# EAGLE design motoko_ice_dragon_v2 (EAGLE 9.6.0)
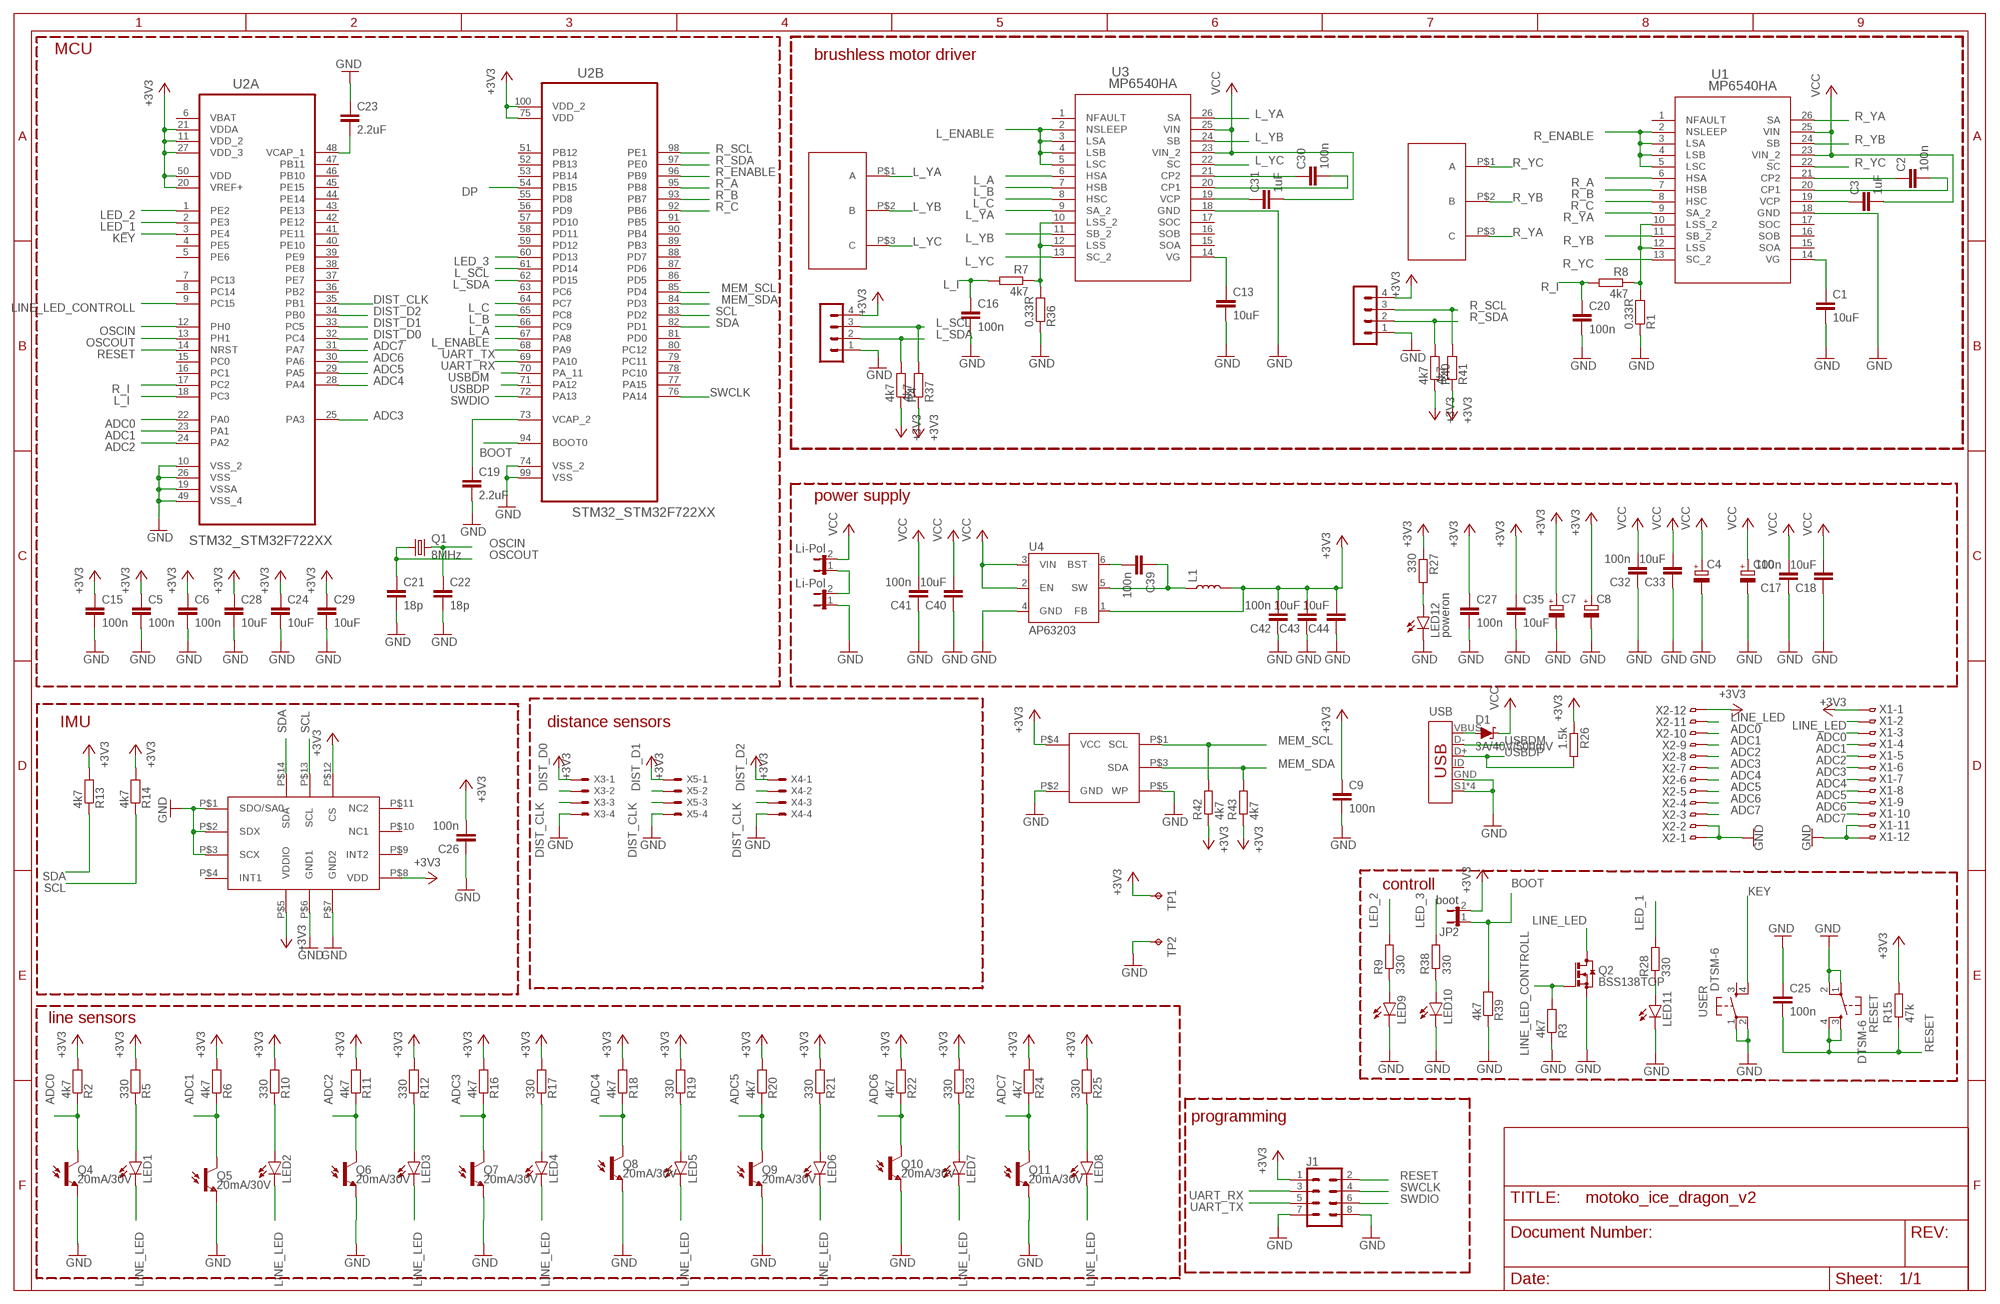
[diagram p0: schematic, sheet 1]

## Parts
C1  10uF  C-EUC0805  [C0805]
C2  100n  C-EUC0805  [C0805]
C3  1uF  C-EUC0805  [C0805]
C4  CPOL-EU085CS-1AR  [085CS_1AR]
C5  100n  C-EUC0805  [C0805]
C6  100n  C-EUC0805  [C0805]
C7  CPOL-EU085CS-1AR  [085CS_1AR]
C8  CPOL-EU085CS-1AR  [085CS_1AR]
C9  100n  C-EUC0805  [C0805]
C10  CPOL-EU085CS-1AR  [085CS_1AR]
C13  10uF  C-EUC0805  [C0805]
C15  100n  C-EUC0805  [C0805]
C16  100n  C-EUC0805  [C0805]
C17  100n  C-EUC0805  [C0805]
C18  10uF  C-EUC0805  [C0805]
C19  2.2uF  C-EUC0805  [C0805]
C20  100n  C-EUC0805  [C0805]
C21  18p  C-EUC0805  [C0805]
C22  18p  C-EUC0805  [C0805]
C23  2.2uF  C-EUC0805  [C0805]
C24  10uF  C-EUC0805  [C0805]
C25  100n  C-EUC0805  [C0805]
C26  100n  C-EUC0805  [C0805]
C27  100n  C-EUC0805  [C0805]
C28  10uF  C-EUC0805  [C0805]
C29  10uF  C-EUC0805  [C0805]
C30  100n  C-EUC0805  [C0805]
C31  1uF  C-EUC0805  [C0805]
C32  100n  C-EUC0805  [C0805]
C33  10uF  C-EUC0805  [C0805]
C35  10uF  C-EUC0805  [C0805]
C39  100n  C-EUC0805  [C0805]
C40  10uF  C-EUC0805  [C0805]
C41  100n  C-EUC0805  [C0805]
C42  100n  C-EUC0805  [C0805]
C43  10uF  C-EUC0805  [C0805]
C44  10uF  C-EUC0805  [C0805]
D1  3A/40V/500mV  DIODE-SCHOTTKY-B340A  [SMA-DIODE]
J1  CONN_04X2  [2X4]
JP1  Li-Pol  JP1E  [JP1]
JP2  boot  JP1E  [JP1]
JP3  Li-Pol  JP1E  [JP1]
L1  4.7uH, TYS50204R7N-10  INDUCTOR-CR54-3.3UH  [CR54]
L_ENCODER  MA04-1  [MA04-1]
L_ENCODER1  MA04-1  [MA04-1]
LED1  LEDCHIPLED_1206  [CHIPLED_1206]
LED2  LEDCHIPLED_1206  [CHIPLED_1206]
LED3  LEDCHIPLED_1206  [CHIPLED_1206]
LED4  LEDCHIPLED_1206  [CHIPLED_1206]
LED5  LEDCHIPLED_1206  [CHIPLED_1206]
LED6  LEDCHIPLED_1206  [CHIPLED_1206]
LED7  LEDCHIPLED_1206  [CHIPLED_1206]
LED8  LEDCHIPLED_1206  [CHIPLED_1206]
LED9  LEDCHIPLED_1206  [CHIPLED_1206]
LED10  LEDCHIPLED_1206  [CHIPLED_1206]
LED11  LEDCHIPLED_1206  [CHIPLED_1206]
LED12  poweron  LEDCHIPLED_1206  [CHIPLED_1206]
Q1  8MHz  CRYSTALCTS406  [CTS406]
Q2  BSS138TOP  [SOT23]
Q4  20mA/30V  PHOTOTRANSISTORPT17-21C-L41-TR8  [PT17-21C-L41-TR8]
Q5  20mA/30V  PHOTOTRANSISTORPT17-21C-L41-TR8  [PT17-21C-L41-TR8]
Q6  20mA/30V  PHOTOTRANSISTORPT17-21C-L41-TR8  [PT17-21C-L41-TR8]
Q7  20mA/30V  PHOTOTRANSISTORPT17-21C-L41-TR8  [PT17-21C-L41-TR8]
Q8  20mA/30V  PHOTOTRANSISTORPT17-21C-L41-TR8  [PT17-21C-L41-TR8]
Q9  20mA/30V  PHOTOTRANSISTORPT17-21C-L41-TR8  [PT17-21C-L41-TR8]
Q10  20mA/30V  PHOTOTRANSISTORPT17-21C-L41-TR8  [PT17-21C-L41-TR8]
Q11  20mA/30V  PHOTOTRANSISTORPT17-21C-L41-TR8  [PT17-21C-L41-TR8]
R1  0.33R  R-EU_M1206  [M1206]
R2  4k7  R-EU_M0805  [M0805]
R3  4k7  R-EU_M0805  [M0805]
R4  4k7  R-EU_M0805  [M0805]
R5  330  R-EU_M0805  [M0805]
R6  4k7  R-EU_M0805  [M0805]
R7  4k7  R-EU_M0805  [M0805]
R8  4k7  R-EU_M0805  [M0805]
R9  330  R-EU_M0805  [M0805]
R10  330  R-EU_M0805  [M0805]
R11  4k7  R-EU_M0805  [M0805]
R12  330  R-EU_M0805  [M0805]
R13  4k7  R-EU_M0805  [M0805]
R14  4k7  R-EU_M0805  [M0805]
R15  47k  R-EU_M0805  [M0805]
R16  4k7  R-EU_M0805  [M0805]
R17  330  R-EU_M0805  [M0805]
R18  4k7  R-EU_M0805  [M0805]
R19  330  R-EU_M0805  [M0805]
R20  4k7  R-EU_M0805  [M0805]
R21  330  R-EU_M0805  [M0805]
R22  4k7  R-EU_M0805  [M0805]
R23  330  R-EU_M0805  [M0805]
R24  4k7  R-EU_M0805  [M0805]
R25  330  R-EU_M0805  [M0805]
R26  1.5k  R-EU_M0805  [M0805]
R27  330  R-EU_M0805  [M0805]
R28  330  R-EU_M0805  [M0805]
R36  0.33R  R-EU_M1206  [M1206]
R37  4k7  R-EU_M0805  [M0805]
R38  330  R-EU_M0805  [M0805]
R39  4k7  R-EU_M0805  [M0805]
R40  4k7  R-EU_M0805  [M0805]
R41  4k7  R-EU_M0805  [M0805]
R42  4k7  R-EU_M0805  [M0805]
R43  4k7  R-EU_M0805  [M0805]
RESET  DTSM-6  [DTSM-6]
TP1  TPB1,27  [B1,27]
TP2  TPB1,27  [B1,27]
U1  MP6540HA  [QFN-5X5_MP6540HA_MNP]
U2  STM32_STM32F722XX  [STM32_QFP50P1600X1600X160-100N]
U3  MP6540HA  [QFN-5X5_MP6540HA_MNP]
U4  AP63203  [SOT23-6]
U$1  BRUSHLESS_GIMBAL_MOTOR_WHEEL  [BRUSHLESS_GIMBAL_MOTOR_WHEEL]
U$2  BRUSHLESS_GIMBAL_MOTOR_WHEEL  [BRUSHLESS_GIMBAL_MOTOR_WHEEL]
U$3  LSM6DSM  [LGA14L]
U$4  24LC24_SOT23  [SOT23]
USB  USB_MINI-B_SMT  [USB-MINIB]
USER  DTSM-6  [DTSM-6]
X1  FH12-12S-0.5SH  [FH12-12S-0.5SH]
X2  FH12-12S-0.5SH  [FH12-12S-0.5SH]
X3  52745-0490  [52745-0490]
X4  52745-0490  [52745-0490]
X5  52745-0490  [52745-0490]

## Nets
+3V3: C5.1 C6.1 C7.+ C8.+ C9.1 C15.1 C24.1 C26.2 C27.1 C28.1 C29.1 C35.1 C42.2 C43.2 C44.2 J1.1 JP2.2 L1.P$2 L_ENCODER1.4 L_ENCODER.4 R2.2 R4.1 R5.2 R6.2 R10.2 R11.2 R12.2 R13.2 R14.2 R15.2 R16.2 R17.2 R18.2 R19.2 R20.2 R21.2 R22.2 R23.2 R24.2 R25.2 R26.1 R27.1 R37.1 R40.1 R41.1 R42.1 R43.1 TP1.TP U2.11(A:VDD_2) U2.20(A:VREF+) U2.21(A:VDDA) U2.27(A:VDD_3) U2.50(A:VDD) U2.75(B:VDD) U2.100(B:VDD_2) U4.1(FB) U$3.P$5(VDDIO) U$3.P$8(VDD) U$3.P$12(CS) U$4.P$4(VCC) X1.1 X2.12 X3.1 X4.1 X5.1
ADC0: Q4.C R2.1 U2.22(A:PA0) X1.3 X2.10
ADC1: Q5.C R6.1 U2.23(A:PA1) X1.4 X2.9
ADC2: Q6.C R11.1 U2.24(A:PA2) X1.5 X2.8
ADC3: Q7.C R16.1 U2.25(A:PA3) X1.6 X2.7
ADC4: Q8.C R18.1 U2.28(A:PA4) X1.7 X2.6
ADC5: Q9.C R20.1 U2.29(A:PA5) X1.8 X2.5
ADC6: Q10.C R22.1 U2.30(A:PA6) X1.9 X2.4
ADC7: Q11.C R24.1 U2.31(A:PA7) X1.10 X2.3
BOOT: JP2.1 R39.2 U2.94(B:BOOT0)
DIST_CLK: U2.35(A:PB1) X3.3 X4.3 X5.3
DIST_D0: U2.32(A:PC4) X3.2
DIST_D1: U2.33(A:PC5) X5.2
DIST_D2: U2.34(A:PB0) X4.2
DP: U2.54(B:PB15)
GND: C1.2 C4.- C5.2 C6.2 C7.- C8.- C9.2 C10.- C13.2 C15.2 C16.2 C17.1 C18.1 C19.2 C20.2 C21.2 C22.2 C23.1 C24.2 C25.1 C26.1 C27.2 C28.2 C29.2 C32.1 C33.1 C35.2 C40.1 C41.1 C42.1 C43.1 C44.1 J1.7 J1.8 JP3.1 L_ENCODER1.1 L_ENCODER.1 LED9.C LED10.C LED11.C LED12.C Q2.2(S) Q4.E Q5.E Q6.E Q7.E Q8.E Q9.E Q10.E Q11.E R1.1 R3.1 R36.1 R39.1 RESET.1 RESET.2 TP2.TP U1.18(GND) U2.10(A:VSS_2) U2.19(A:VSSA) U2.26(A:VSS) U2.49(A:VSS_4) U2.74(B:VSS_2) U2.99(B:VSS) U3.18(GND) U4.4(GND) U$3.P$1(SDO/SA0) U$3.P$2(SDX) U$3.P$3(SCX) U$3.P$6(GND1) U$3.P$7(GND2) U$4.P$2(GND) U$4.P$5(WP) USB.GND USB.S1(SHIELD) USB.S2(SHIELD) USB.S3(SHIELD) USB.S4(SHIELD) USER.1 USER.2 X1.11 X1.12 X2.1 X2.2 X3.4 X4.4 X5.4
KEY: U2.3(A:PE4) USER.4
L_A: U2.66(B:PC9) U3.6(HSA)
L_B: U2.65(B:PC8) U3.7(HSB)
L_C: U2.64(B:PC7) U3.8(HSC)
L_ENABLE: U2.67(B:PA8) U3.2(NSLEEP) U3.3(LSA) U3.4(LSB) U3.5(LSC)
L_I: C16.1 R7.2 U2.18(A:PC3)
L_SCL: L_ENCODER.3 R37.2 U2.61(B:PD14)
L_SDA: L_ENCODER.2 R4.2 U2.62(B:PD15)
L_YA: U3.9(SA_2) U3.26(SA) U$1.P$1(A)
L_YB: U3.11(SB_2) U3.24(SB) U$1.P$2(B)
L_YC: U3.13(SC_2) U3.22(SC) U$1.P$3(C)
LED_1: R28.2 U2.2(A:PE3)
LED_2: R9.2 U2.1(A:PE2)
LED_3: R38.2 U2.60(B:PD13)
LINE_LED: LED1.C LED2.C LED3.C LED4.C LED5.C LED6.C LED7.C LED8.C Q2.3(D) X1.2 X2.11
LINE_LED_CONTROLL: Q2.1(G) R3.2 U2.9(A:PC15)
MEM_SCL: R42.2 U2.85(B:PD4) U$4.P$1(SCL)
MEM_SDA: R43.2 U2.84(B:PD3) U$4.P$3(SDA)
N$1: R7.1 R36.2 U3.10(LSS_2) U3.12(LSS)
N$2: C1.1 U1.14(VG)
N$3: C2.1 U1.21(CP2)
N$4: C2.2 U1.20(CP1)
N$5: C3.1 U1.19(VCP)
N$6: D1.A USB.VBUS
N$7: JP1.1 JP3.2
N$8: R1.2 R8.1 U1.10(LSS_2) U1.12(LSS)
N$9: LED9.A R9.1
N$10: C13.1 U3.14(VG)
N$11: LED10.A R38.1
N$12: C31.1 U3.19(VCP)
N$14: LED1.A R5.1
N$15: LED2.A R10.1
N$16: LED3.A R12.1
N$17: LED4.A R17.1
N$18: LED5.A R19.1
N$19: LED6.A R21.1
N$20: LED7.A R23.1
N$21: LED8.A R25.1
N$22: C39.2 U4.6(BST)
N$23: LED12.A R27.2
N$25: C19.1 U2.73(B:VCAP_2)
N$26: C39.1 L1.P$1 U4.5(SW)
N$30: C23.2 U2.48(A:VCAP_1)
N$31: C30.1 U3.21(CP2)
N$33: LED11.A R28.1
N$34: C30.2 U3.20(CP1)
OSCIN: C22.1 Q1.3 U2.12(A:PH0)
OSCOUT: C21.1 Q1.1 U2.13(A:PH1)
R_A: U1.6(HSA) U2.95(B:PB8)
R_B: U1.7(HSB) U2.93(B:PB7)
R_C: U1.8(HSC) U2.92(B:PB6)
R_ENABLE: U1.2(NSLEEP) U1.3(LSA) U1.4(LSB) U1.5(LSC) U2.96(B:PB9)
R_I: C20.1 R8.2 U2.17(A:PC2)
R_SCL: L_ENCODER1.3 R41.2 U2.98(B:PE1)
R_SDA: L_ENCODER1.2 R40.2 U2.97(B:PE0)
R_YA: U1.9(SA_2) U1.26(SA) U$2.P$3(C)
R_YB: U1.11(SB_2) U1.24(SB) U$2.P$2(B)
R_YC: U1.13(SC_2) U1.22(SC) U$2.P$1(A)
RESET: C25.2 J1.2 R15.1 RESET.3 RESET.4 U2.14(A:NRST)
SCL: R14.1 U2.83(B:PD2) U$3.P$13(SCL)
SDA: R13.1 U2.82(B:PD1) U$3.P$14(SDA)
SWCLK: J1.4 U2.76(B:PA14)
SWDIO: J1.6 U2.72(B:PA13)
UART_RX: J1.3 U2.69(B:PA10)
UART_TX: J1.5 U2.68(B:PA9)
USBDM: U2.70(B:PA_11) USB.D-
USBDP: R26.2 U2.71(B:PA12) USB.D+
VCC: C3.2 C4.+ C10.+ C17.2 C18.2 C31.2 C32.2 C33.2 C40.2 C41.2 D1.C JP1.2 U1.23(VIN_2) U1.25(VIN) U3.23(VIN_2) U3.25(VIN) U4.2(EN) U4.3(VIN)
Unconnected: U1.1(NFAULT) U1.15(SOA) U1.16(SOB) U1.17(SOC) U2.4(A:PE5) U2.5(A:PE6) U2.7(A:PC13) U2.8(A:PC14) U2.15(A:PC0) U2.16(A:PC1) U2.36(A:PB2) U2.37(A:PE7) U2.38(A:PE8) U2.39(A:PE9) U2.40(A:PE10) U2.41(A:PE11) U2.42(A:PE12) U2.43(A:PE13) U2.44(A:PE14) U2.45(A:PE15) U2.46(A:PB10) U2.47(A:PB11) U2.51(B:PB12) U2.52(B:PB13) U2.53(B:PB14) U2.55(B:PD8) U2.56(B:PD9) U2.57(B:PD10) U2.58(B:PD11) U2.59(B:PD12) U2.63(B:PC6) U2.77(B:PA15) U2.78(B:PC10) U2.79(B:PC11) U2.80(B:PC12) U2.81(B:PD0) U2.86(B:PD5) U2.87(B:PD6) U2.88(B:PD7) U2.89(B:PB3) U2.90(B:PB4) U2.91(B:PB5) U3.1(NFAULT) U3.15(SOA) U3.16(SOB) U3.17(SOC) U$3.P$4(INT1) U$3.P$9(INT2) U$3.P$10(NC1) U$3.P$11(NC2) USB.ID USER.3

## Notes on the sheet
- MCU
- brushless motor driver
- power supply
- IMU | distance sensors
- controll
- line sensors
- programming

## Power pins joined to a net without a drawn wire
VBAT: U2.6(A:VBAT)

## Library data of the parts
C1-C3 C5 C6 C9 C13 C15-C33 C35 C39-C44 = resistor:C-EU: CAPACITOR, European symbol
C4 C7 C8 C10 = rcl:CPOL-EU: POLARIZED CAPACITOR, European symbol; SPICEPREFIX: C
D1 = SparkFun-DiscreteSemi:DIODE-SCHOTTKY: Schottky diode A Schottky diode is a semiconductor diode which has a low forward voltage drop and a very fast switching action.; PROD_ID: DIO-09886
J1 = SparkFun-Connectors:CONN_04X2: Multi connection point. Often used as Generic Header-pin footprint for 0.1 inch spaced/style header connections On any of the 0.1 inch spaced packages, you can populate with these: Break Away Headers - Straight <https://www.sparkfun.com/products/116> (PRT-00116) Break Away Male Headers - Right Angle <https://www.sparkfun.com/products/553> (PRT-00553) Female Headers <https://www.sparkfun.com/products/115> (PRT-00115) Break Away Headers - Machine Pin <https://www.sparkfun.com/products/117> (PRT-00117) Break Away Female Headers - Swiss Machine Pin <https://www.sparkfun.com/products/743> (PRT-00743)
JP1-JP3 = jumper:JP1E: JUMPER
L1 = SparkFun-Coils:INDUCTOR: Inductors Resist changes in electrical current. Basically a coil of wire. SparkFun Products: SparkFun Load Cell Amplifier - HX711 <https://www.sparkfun.com/products/13879> IOIO-OTG - V2.2 <https://www.sparkfun.com/products/13613>; PROD_ID: NDUC-11157; VALUE: 3.3µH/±30%/3.4A
L_ENCODER L_ENCODER1 = con-lstb:MA04-1: PIN HEADER; OC_FARNELL: unknown; OC_NEWARK: unknown
LED1-LED12 = led:LED: LED OSRAM: - CHIPLED LG R971, LG N971, LY N971, LG Q971, LY Q971, LO R971, LY R971 LH N974, LH R974 LS Q976, LO Q976, LY Q976 LO Q996 - Hyper CHIPLED LW Q18S LB Q993, LB Q99A, LB R99A - SideLED LS A670, LO A670, LY A670, LG A670, LP A670 LB A673, LV A673, LT A673, LW A673 LH A674 LY A675 LS A676, LA A676, LO A676, LY A676, LW A676 LS A679, LY A679, LG A679 - Hyper Micro SIDELED® LS Y876, LA Y876, LO Y876, LY Y876 LT Y87S - SmartLED LW L88C, LW L88S LB L89C, LB L89S, LG L890 LS L89K, LO L89K, LY L89K LS L896, LA L896, LO L896, LY L896 - TOPLED LS T670, LO T670, LY T670, LG T670, LP T670 LSG T670, LSP T670, LSY T670, LOP T670, LYG T670 LG T671, LOG T671, LSG T671 LB T673, LV T673, LT T673, LW T673 LH T674 LS T676, LA T676, LO T676, LY T676, LB T676, LH T676, LSB T676, LW T676 LB T67C, LV T67C, LT T67C, LS T67K, LO T67K, LY T67K, LW E67C LS E67B, LA E67B, LO E67B, LY E67B, LB E67C, LV E67C, LT E67C LW T67C LS T679, LY T679, LG T679 LS T770, LO T770, LY T770, LG T770, LP T770 LB T773, LV T773, LT T773, LW T773 LH T774 LS E675, LA E675, LY E675, LS T675 LS T776, LA T776, LO T776, LY T776, LB T776 LHGB T686 LT T68C, LB T68C - Hyper Mini TOPLED® LB M676 - Mini TOPLED Santana® LG M470 LS M47K, LO M47K, LY M47K Source: http://www.osram.convergy.de LUXEON: - LUMILED® LXK2-PW12-R00, LXK2-PW12-S00, LXK2-PW14-U00, LXK2-PW14-V00 LXK2-PM12-R00, LXK2-PM12-S00, LXK2-PM14-U00 LXK2-PE12-Q00, LXK2-PE12-R00, LXK2-PE12-S00, LXK2-PE14-T00, LXK2-PE14-U00 LXK2-PB12-K00, LXK2-PB12-L00, LXK2-PB12-M00, LXK2-PB14-N00, LXK2-PB14-P00, LXK2-PB14-Q00 LXK2-PR12-L00, LXK2-PR12-M00, LXK2-PR14-Q00, LXK2-PR14-R00 LXK2-PD12-Q00, LXK2-PD12-R00, LXK2-PD12-S00 LXK2-PH12-R00, LXK2-PH12-S00 LXK2-PL12-P00, LXK2-PL12-Q00, LXK2-PL12-R00 Source: www.luxeon.com KINGBRIGHT: KA-3528ASYC Source: www.kingbright.com
Q1 = crystal:CRYSTAL: CRYSTAL; OC_FARNELL: unknown; OC_NEWARK: unknown
Q2 = JCM:BSS138
Q4-Q11 = SparkFun-DiscreteSemi:PHOTOTRANSISTOR: Phototransistor PT17-21C/L41/TR8 is a phototransistor in miniature SMD package which is molded in a water clear with flat top view lens. The device is Spectrally matched to visible and infrared emitting diode. Datasheet <http://www.everlight.com/file/ProductFile/PT17-21C-L41-TR8.pdf> SparkFun Products: SparkFun Electric Imp imp002 Breakout <https://www.sparkfun.com/products/12958>; PROD_ID: TRANS-12141
R1 R36 R42 R43 = rcl:R-EU_: RESISTOR, European symbol; SPICEPREFIX: R
R2-R28 R37-R41 = resistor:R-EU_: RESISTOR, European symbol
RESET USER = switch-tact:DTSM-6
TP1 TP2 = testpad:TP: Test pad
U1 U3 = my_library:MP6540HA; BUILT_BY: EMA_Justin; COPYRIGHT: Copyright (C) 2018 Accelerated Designs. All rights reserved; DATASHEET: https://www.monolithicpower.com/en/documentview/productdocument/index/version/2/document_type/Datasheet/lang/en/sku/MP6540HA/document_id/6884/; MANUFACTURER_PART_NUMBER: MP6540HA; SOURCELIBRARY: Monolithic_Power_Systems_2020-10-09; VENDOR: Monolithic Power Systems Inc
U2 = ascender_board:STM32_STM32F722XX: IC, MCU, 32BIT, 512K FLASH, 100LQFP; MPN: STM32F407VET6; OC_FARNELL: 2064367; OC_NEWARK: 73T2332; PACKAGE: 100LQFP; SUPPLIER: STMicroelectronics
U4 = SparkFun-IC-Power:AP63203: Diodes Inc. AP63203 3.8V-32V input 3.3V Buck The AP63200/AP63201/AP63203/AP63205 is a 2A, synchronous buck converter with a wide input voltage range of 3.8V to 32V and fully integrates a 125mΩ high-side power MOSFET and a 68mΩ lowside power MOSFET to provide high-efficiency step-down DC/DC conversion; PROD_ID: VREG-15244
U$1 U$2 = my_library:BRUSHLESS_GIMBAL_MOTOR_WHEEL
U$3 = my_library:LSM6DSM
U$4 = my_library:24LC24_SOT23
USB = SparkFun-Connectors:USB_MINI-B: USB type Mini-B Connector Breaks out 5th pin, and includes shield pins if needed. SparkFun Products: SparkFun FTDI Basic Breakout <https://www.sparkfun.com/products/9716> SparkFun XBee Explorer USB <https://www.sparkfun.com/products/11812> SparkFun Redboard <https://www.sparkfun.com/products/12757>; PROD_ID: CONN-08193; SF_ID: PRT-00587
X1 X2 = con-hirose:FH12-12S-0.5S: 0.5mm Pitch Connectors For FPC/FFC Source: Data sheet <http://www.hirose.co.jp/cataloge_hp/e58605370.pdf>; MPN: FH12-12S-0.5SH(55); OC_FARNELL: 1324542; OC_NEWARK: 34M6155
X3-X5 = con-molex:52745-0490: FFC/FPC-to-Board 0.50mm (.020") SMT Top Contact Right Angle, ZIF, Style Receptacle 52745 / 52435 Source: http://www.molex.com/product/ffc/52745.html; MF: MOLEX; MPN: 52745-0490; OC_FARNELL: unknown; OC_NEWARK: 61H4699

## Board
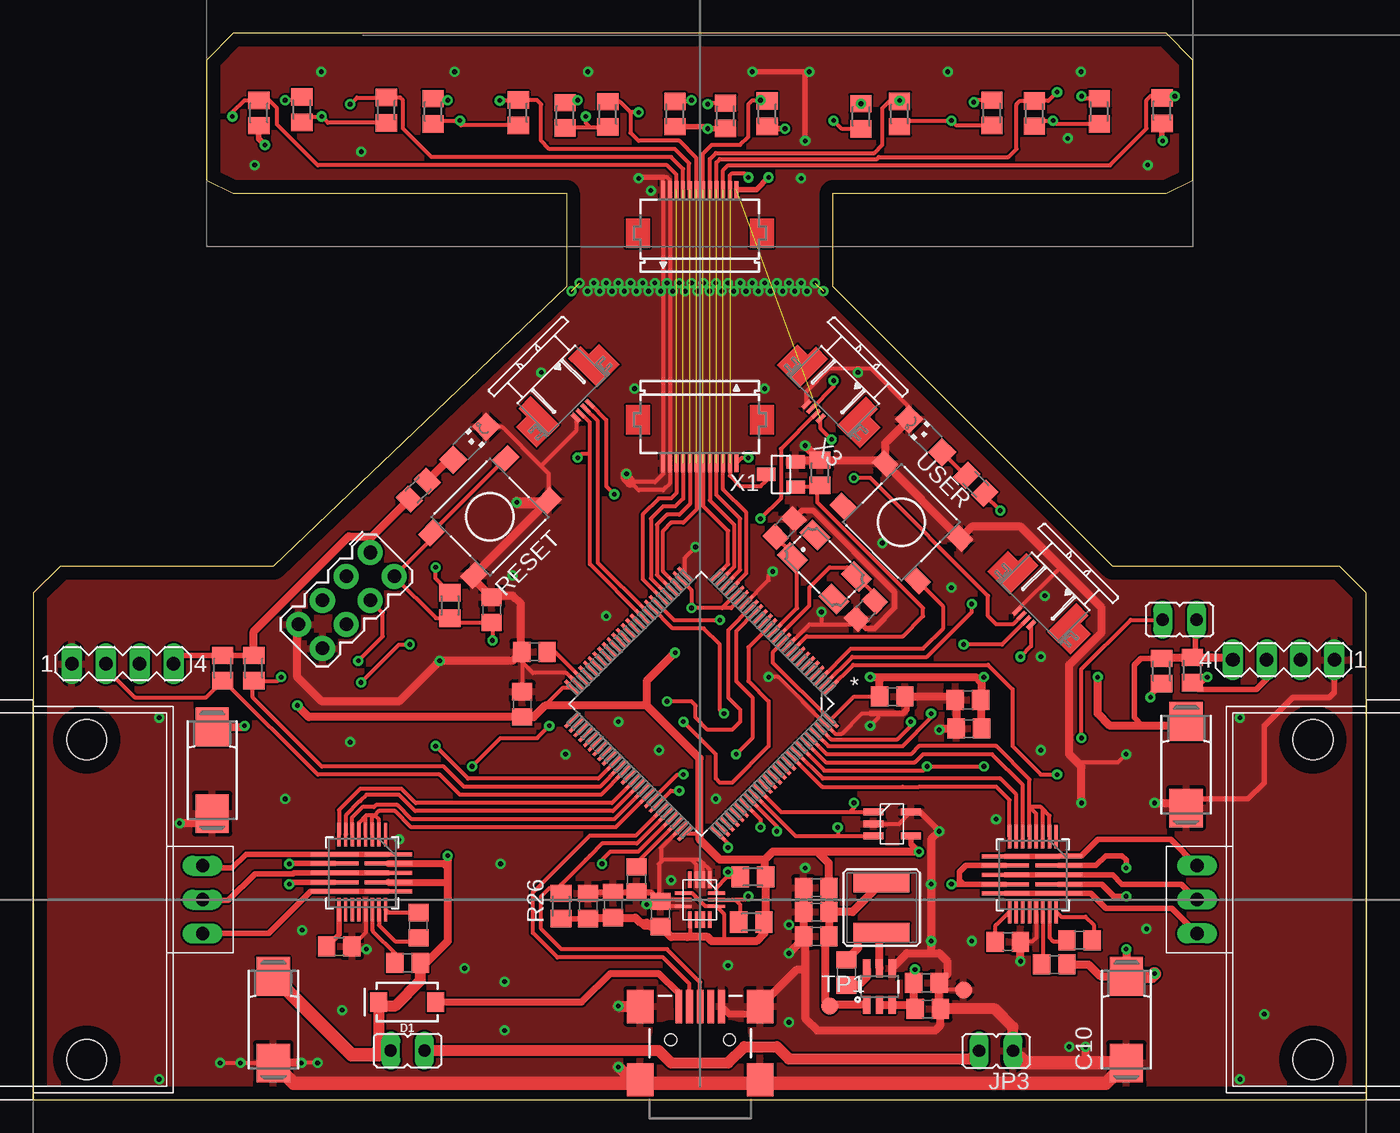
[diagram p1: board, top side]
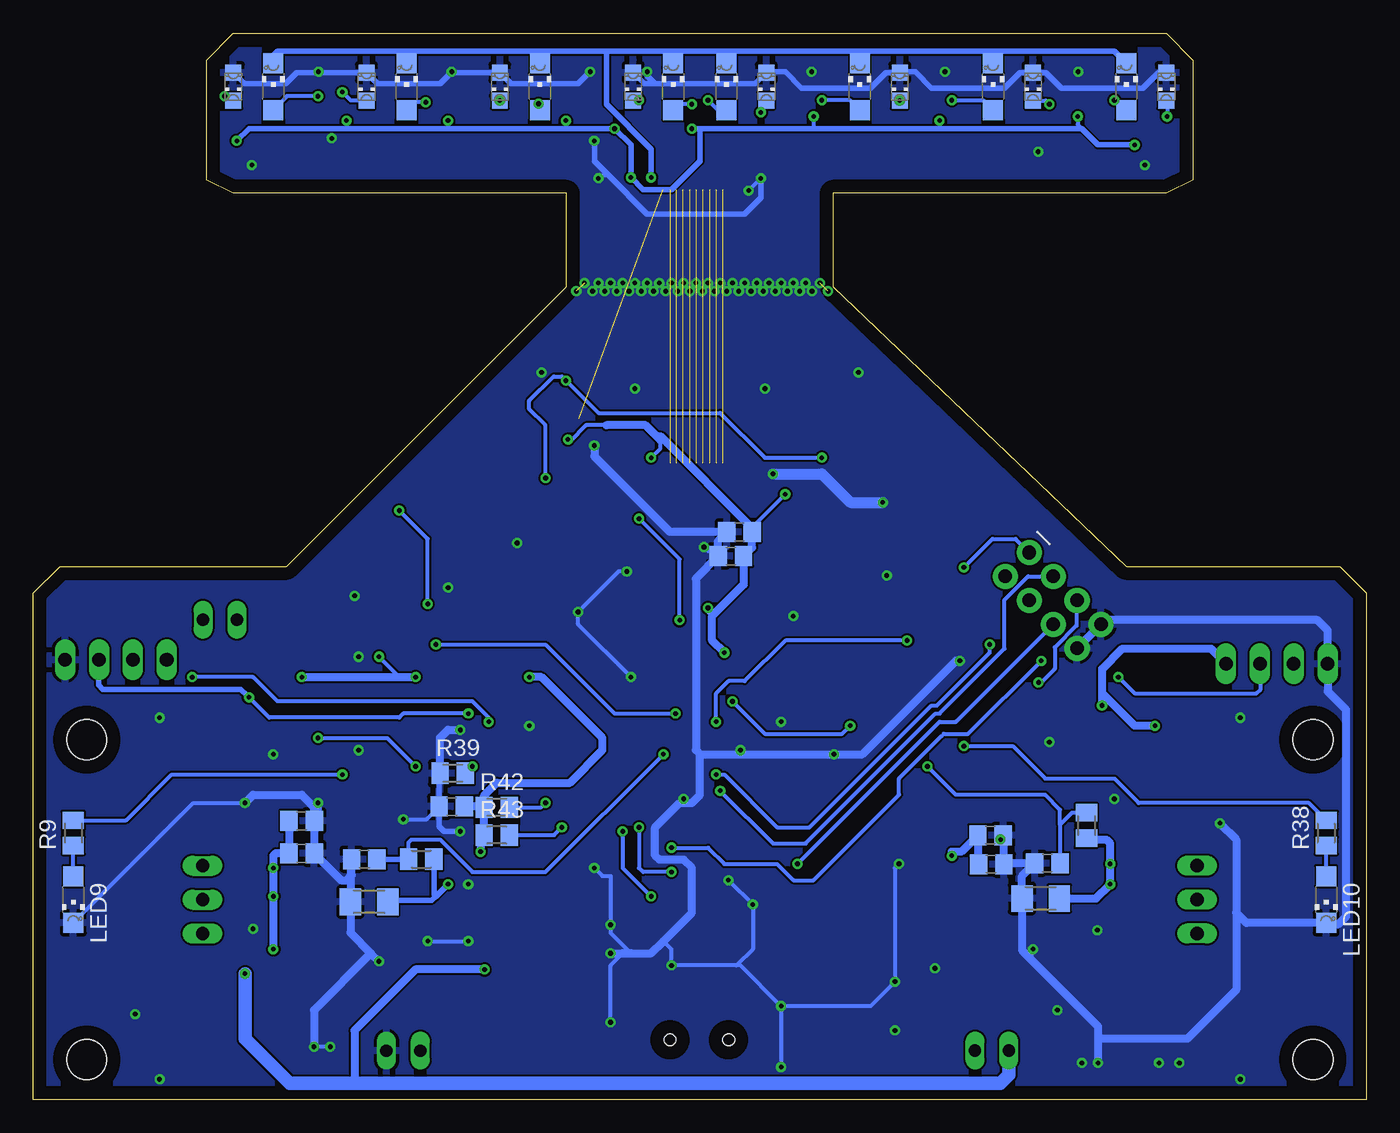
[diagram p2: board, bottom side, seen from below]

Size 100 x 80 mm. Coordinates in mm from the lower left corner, seen from the top.
Outline: 0,0 100,0 100,38 98,40 81,40 60,61 60,68 85,68 87,69 87,78 85,80 15,80 13,78 13,69 15,68 40,68 40,61 18,40 2,40 0,38 0,0
Copper layers (1*16): Top 0.035mm / dielectric 1.5mm / Bottom 0.035mm
Design rules "default": minimum track width 6mil, minimum drill 0.35mm, track to track 6mil, track to pad 6mil, pad to pad 6mil, via to via 6mil, smd to smd 6mil, copper to edge 40mil, drill to drill 6mil, minimum pad ring 10mil, minimum via ring 8mil, stop-mask expansion 4mil, vias tented up to drill 0mil, thermal gap 10mil

### Footprints (pad centres in the part's own frame; a part is rotated, then mirrored left to right if it is on the bottom)
C0805 = smd 1.3 x 1.5: 1 -0.95,0; 2 0.95,0
085CS_1AR = smd 2.9 x 2.5: + 3.25,0; - -3.25,0
SMA-DIODE = smd 1.27 x 1.47: A -2.15,0; C 2.15,0
2X4 = drill 1.016 pad 1.88: 1 -3.81,-1.27; 2 -3.81,1.27; 3 -1.27,-1.27; 4 -1.27,1.27; 5 1.27,-1.27; 6 1.27,1.27; 7 3.81,-1.27; 8 3.81,1.27
JP1 = drill 0.914 long: 1 0,-1.27; 2 0,1.27
CR54 = smd 4.2 x 1.4: P$1 0,1.85; P$2 0,-1.85
MA04-1 = drill 1.016 long: 1 -3.81,0; 2 -1.27,0; 3 1.27,0; 4 3.81,0
CHIPLED_1206 = smd 1.5 x 1.5: A 0,-1.75; C 0,1.75
CTS406 = smd 1.9 x 1.4: 1 -2.2,-1.2; 2 2.2,-1.2; 3 2.2,1.2; 4 -2.2,1.2
SOT23 = smd 1 x 1.4: 1 -0.95,-1.1; 2 0.95,-1.1; 3 0,1.1
PT17-21C-L41-TR8 = smd 1.2 x 1.2: C 0,1.05; E 0,-1.05
M1206 = smd 1.6 x 2: 1 -1.4,0; 2 1.4,0
M0805 = smd 1.3 x 1.6: 1 -0.95,0; 2 0.95,0
DTSM-6 = smd 1.55 x 1.3: 1 -3.975,2.25; 2 3.975,2.25; 3 -3.975,-2.25; 4 3.975,-2.25
B1,27 = smd 1.27 x 1.27: TP 0,0
QFN-5X5_MP6540HA_MNP = smd 1.778 x 0.254: 1 -2.858,1.75; 2 -2.858,1.25; 3 -2.858,0.75; 4 -2.858,0.25; 5 -2.858,-0.25; 6 -2.858,-0.75; 7 -2.858,-1.25; 8 -2.858,-1.75; 14 2.756,-1.75; 15 2.756,-1.25; 16 2.756,-0.75; 17 2.756,-0.25; 18 2.756,0.25; 19 2.756,0.75; 20 2.756,1.25; 21 2.756,1.75 | smd 0.305 x 3.556: 9 -1.4,-2.058; 10 -0.7,-2.058; 11 0,-2.058; 12 0.7,-2.058; 13 1.4,-2.058; 22 1.4,1.956; 23 0.7,1.956; 24 0,1.956; 25 -0.7,1.956; 26 -1.4,1.956
STM32_QFP50P1600X1600X160-100N = smd 1.473 x 0.254: 1 -7.722,5.994; 2 -7.722,5.512; 3 -7.722,5.004; 4 -7.722,4.496; 5 -7.722,3.988; 6 -7.722,3.505; 7 -7.722,2.997; 8 -7.722,2.489; 9 -7.722,2.007; 10 -7.722,1.499; 11 -7.722,0.991; 12 -7.722,0.508; 13 -7.722,0; 14 -7.722,-0.508; 15 -7.722,-0.991; 16 -7.722,-1.499; 17 -7.722,-2.007; 18 -7.722,-2.489; 19 -7.722,-2.997; 20 -7.722,-3.505; 21 -7.722,-3.988; 22 -7.722,-4.496; 23 -7.722,-5.004; 24 -7.722,-5.512; 25 -7.722,-5.994; 51 7.722,-5.994; 52 7.722,-5.512; 53 7.722,-5.004; 54 7.722,-4.496; 55 7.722,-3.988; 56 7.722,-3.505; 57 7.722,-2.997; 58 7.722,-2.489; 59 7.722,-2.007; 60 7.722,-1.499; 61 7.722,-0.991; 62 7.722,-0.508; 63 7.722,0; 64 7.722,0.508; 65 7.722,0.991; 66 7.722,1.499; 67 7.722,2.007; 68 7.722,2.489; 69 7.722,2.997; 70 7.722,3.505; 71 7.722,3.988; 72 7.722,4.496; 73 7.722,5.004; 74 7.722,5.512; 75 7.722,5.994 | smd 0.254 x 1.473: 26 -5.994,-7.722; 27 -5.512,-7.722; 28 -5.004,-7.722; 29 -4.496,-7.722; 30 -3.988,-7.722; 31 -3.505,-7.722; 32 -2.997,-7.722; 33 -2.489,-7.722; 34 -2.007,-7.722; 35 -1.499,-7.722; 36 -0.991,-7.722; 37 -0.508,-7.722; 38 0,-7.722; 39 0.508,-7.722; 40 0.991,-7.722; 41 1.499,-7.722; 42 2.007,-7.722; 43 2.489,-7.722; 44 2.997,-7.722; 45 3.505,-7.722; 46 3.988,-7.722; 47 4.496,-7.722; 48 5.004,-7.722; 49 5.512,-7.722; 50 5.994,-7.722; 76 5.994,7.722; 77 5.512,7.722; 78 5.004,7.722; 79 4.496,7.722; 80 3.988,7.722; 81 3.505,7.722; 82 2.997,7.722; 83 2.489,7.722; 84 2.007,7.722; 85 1.499,7.722; 86 0.991,7.722; 87 0.508,7.722; 88 0,7.722; 89 -0.508,7.722; 90 -0.991,7.722; 91 -1.499,7.722; 92 -2.007,7.722; 93 -2.489,7.722; 94 -2.997,7.722; 95 -3.505,7.722; 96 -3.988,7.722; 97 -4.496,7.722; 98 -5.004,7.722; 99 -5.512,7.722; 100 -5.994,7.722
SOT23-6 = smd 0.55 x 1.35: 1 -0.95,-1.375; 2 0,-1.375; 3 0.95,-1.375; 4 0.95,1.375; 5 0,1.375; 6 -0.95,1.375
BRUSHLESS_GIMBAL_MOTOR_WHEEL = drill 1 long: P$1 12.7,2.54; P$2 12.7,0; P$3 12.7,-2.54 | hole 3: 4,-12; 4,12
LGA14L = smd 1.25 x 0.25: P$1 -1.5,0.75; P$2 -1.5,0.25; P$3 -1.5,-0.25; P$4 -1.5,-0.75; P$8 1.5,-0.75; P$9 1.5,-0.25; P$10 1.5,0.25; P$11 1.5,0.75 | smd 0.25 x 1.25: P$5 -0.5,-1.25; P$6 0,-1.25; P$7 0.5,-1.25; P$12 0.5,1.25; P$13 0,1.25; P$14 -0.5,1.25
SOT23' = smd 0.5 x 1.5: P$1 -0.9,-0.5; P$2 0,-0.5; P$3 0.9,-0.5; P$4 0.9,2.3; P$5 -0.9,2.3
USB-MINIB = smd 2.5 x 0.5: D+ 2.5,0; D- 2.5,0.8; GND 2.5,-1.6; ID 2.5,-0.8; VBUS 2.5,1.6 | smd 2.5 x 2: S1 -3,4.5; S2 2.5,4.5; S3 -3,-4.5; S4 2.5,-4.5 | hole 0.9: 0,2.2; 0,-2.2
FH12-12S-0.5SH = smd 0.3 x 1.3: 1 -2.75,3.25; 2 -2.25,3.25; 3 -1.75,3.25; 4 -1.25,3.25; 5 -0.75,3.25; 6 -0.25,3.25; 7 0.25,3.25; 8 0.75,3.25; 9 1.25,3.25; 10 1.75,3.25; 11 2.25,3.25; 12 2.75,3.25
52745-0490 = smd 0.3 x 0.8: 1 -0.75,2.5; 2 -0.25,2.5; 3 0.25,2.5; 4 0.75,2.5

### Placement (x,y rotation side)
C1  73.11,11.84 0 top
C2  78.49,11.95 180 top
C3  76.6,10.14 0 top
C4  18,6 90 top
C5  36.68,29.65 90 top
C6  64.44,30.23 0 top
C7  13.42,24.71 90 top
C8  86.49,25.12 90 top
C9  70.12,29.98 180 top
C10  82,6 90 top
C13  22.95,11.48 0 top
C15  43.5,14.6 90 top
C16  23.92,17.73 180 bottom
C17  79.87,20.91 180 bottom
C18  79.87,18.47 180 bottom
C19  45.26,16.51 270 top
C20  75.17,18.03 180 bottom
C21  56.37,42.89 45 top
C22  62.46,36.73 225 top
C23  37.59,33.6 0 top
C24  70.19,27.83 180 top
C25  34.39,36.75 270 top
C26  47.05,13.91 270 top
C27  47.02,42.58 180 bottom
C28  41.63,14.52 90 top
C29  47.67,40.77 180 bottom
C30  28.9,13.08 270 top
C31  28.08,10.26 0 top
C32  28.13,17.65 180 bottom
C33  28.18,19.83 180 bottom
C35  68.6,21.98 180 bottom
C39  61.01,9.53 270 top
C40  67.11,6.79 180 top
C41  67.01,8.75 180 top
C42  58.74,12.24 0 top
C43  58.74,15.9 0 top
C44  58.74,14.07 0 top
D1  28.04,7.32 180 top
J1  23.48,37.45 225 top
JP1  28.08,3.68 90 top
JP2  86,36 270 top
JP3  72.24,3.66 90 top
L1  63.64,14.4 180 top
L_ENCODER  6.71,32.7 0 top
L_ENCODER1  93.8,33 180 top
LED1  82,76 0 bottom
LED2  72,76 0 bottom
LED3  62,76 0 bottom
LED4  52,76 0 bottom
LED5  38,76 0 bottom
LED6  28,76 0 bottom
LED7  18,76 0 bottom
LED8  48,76 0 bottom
LED9  97,15 180 bottom
LED10  3,15 180 bottom
LED11  66.95,49.8 45 top
LED12  32.74,49.25 315 top
Q1  59.36,39.96 315 top
Q2  56.1,46.9 90 top
Q4  85,76 180 bottom
Q5  75,76 180 bottom
Q6  65,76 180 bottom
Q7  55,76 180 bottom
Q8  45,76 180 bottom
Q9  35,76 180 bottom
Q10  25,76 180 bottom
Q11  15,76 180 bottom
R1  74.81,14.83 0 bottom
R2  84.68,74.19 270 top
R3  59.02,47.03 270 top
R4  14.2,32.37 270 top
R5  79.97,74.14 270 top
R6  75.11,73.98 270 top
R7  20.98,20.56 90 bottom
R8  70.9,18.03 180 bottom
R9  97,20 90 bottom
R10  71.91,74.03 270 top
R11  64.98,73.95 270 top
R12  62.1,73.77 270 top
R13  53.99,16.7 0 top
R14  53.87,13.32 0 top
R15  31.26,37.07 90 top
R16  55.06,73.96 270 top
R17  51.93,73.81 270 top
R18  43.1,73.92 270 top
R19  39.9,73.84 270 top
R20  36.39,74.04 270 top
R21  29.99,74.14 270 top
R22  26.49,74.23 270 top
R23  20.15,74.27 270 top
R24  16.92,74.02 270 top
R25  48.14,73.94 270 top
R26  39.59,14.52 90 top
R27  28.89,45.73 45 top
R28  70.7,46.16 315 top
R36  24.42,15.08 0 bottom
R37  16.54,32.37 270 top
R38  3,20 90 bottom
R39  68.53,24.48 0 bottom
R40  84.65,32.15 270 top
R41  86.95,32.22 270 top
R42  65.23,21.92 0 bottom
R43  65.23,19.84 0 bottom
RESET  34.26,43.72 225 top
TP1  59.74,7.01 0 top
TP2  69.8,8.23 0 top
U1  74.99,16.86 270 top
U2  50.12,29.68 225 top
U3  24.68,17.01 270 top
U4  63.48,8.48 0 top
U$1  0,15 0 top
U$2  100,15 180 top
U$3  50,15 270 top
U$4  24LC24_SOT23  [SOT23']  63.55,20.68 270 top
USB  50.03,4.48 90 top
USER  65.13,43.31 315 top
X1  50,51 180 top
X2  50,65.01 0 top
X3  60.31,53.4 135 top
X4  39.47,53.44 225 top
X5  76.09,37.91 135 top

### Tracks (layer width: path | path; a pad name or v marks a point on that pad's centre or on a via)
+3V3  (via drill 0.35)  (1 unrouted)
  Top 0.305: 52.75,47.53 X1.1 53.16,48.16 v53.65,48.16 | R23.2 20.6,73.76 v21.64,73.76 22.12,73.28 R22.2 | R21.2 30.26,73.46 31.7,73.46 | 31.7,73.46 v32,73.46 | R20.2 32.06,73.09 31.7,73.46 | R19.2 39.97,72.97 41.76,72.97 | 41.76,72.97 R18.2 | 41.76,72.97 41.45,73.27 v41.45,73.76 | R10.2 69.26,73.08 v68.89,73.46 65.44,73.46 R11.2 | R12.2 60.68,72.83 v60.05,73.46 | R6.2 75.53,73.46 v76.5,73.46 76.77,73.19 R5.2 | U$3.P$5 49.43,15.5 49.68,15.25 49.68,15.24 50.42,14.5 U$3.P$12 51.82,13.93 51.82,11.89 | 49.88,12.19 50.6,12.19 | U$3.P$8 49.25,12.37 49.07,12.19 | C6.1 63.4,30.23 61.58,30.23 U2.100 55.47,32.81 55.47,33.53 56.28,34.33 U2.11 | U2.75 49.81,19.99 49.99,19.81 | X5.1 74.86,34.01 v74.07,33.22 | v71.32,31.7 70.71,31.7 | TP1.TP 59.84,7.11 60.96,7.11 | R15.2 30.18,39.11 v30.18,39.93 | 37.49,28.7 37.54,28.7 39.74,30.91 U2.50 | X4.1 42.98,50.99 42.98,46.02 v43.59,45.41 | U2.27 49.38,38.22 v49.38,36.88 51.67,36.88 | U2.21 51.67,36.88 | U2.20 52.36,36.88 51.67,36.88 | v59.89,49.53 59.07,50.35 X3.1
  Top 0.406: X2.12 54.24,68.26 v55.17,69.19 | v56.39,72.85 55.22,72.85 R16.2 | R24.2 16.92,72.08 v17.37,71.63 | R17.2 51.92,72.85 v50.6,72.85 50.45,72.99 R25.2 | v84.73,71.93 84.69,71.98 R2.2 | 54.86,13.36 R14.2 54.82,13.11 54.82,12.46 | 47.24,12.8 47.08,12.96 | C26.2 46.33,12.96 45.86,12.96 45.57,13.26 | C28.1 R26.1 | U$4.P$4 65.85,19.19 v66.45,18.59 | 71.14,29.91 C9.1 71.07,31.35 | 63.7,31.7 63.4,31.39 63.4,30.23 | 88.39,33.17 87.17,33.17 | 87.17,33.17 R41.1 | JP2.2 87.17,35.9 87.17,33.17 | C8.+ 86.77,28.65 | R40.1 83.09,33.1 82.6,32.61 82.6,28.65 83.21,28.04 85.34,28.04 | L_ENCODER.4 11.14,33.32 R4.1 R37.1
  Top 0.61: L1.P$2 61.47,14.07 C44.2 | C44.2 C43.2 59.69,17.73 58.83,18.59 | C44.2 C42.2 59.44,11.99 59.44,7.32 59.64,7.11 60.96,7.11 U4.1 | 54.86,13.15 54.82,13.11 | C28.1 41.71,13.65 C15.1 45.18,13.65 45.57,13.26 46.03,13.26 46.33,12.96 | C26.2 47.08,12.96 | 47.24,12.8 47.85,12.19 49.07,12.19 50.6,12.19 50.9,11.89 51.82,11.89 54.25,11.89 54.82,12.46 R14.2 54.94,13.43 R13.2 54.86,16.77 54.86,17.98 | v66.45,18.59 58.83,18.59 | 71.02,27.96 C24.1 71.14,29.91 71.14,31.27 71.07,31.35 70.71,31.7 63.7,31.7 | C6.1 63.49,31.49 63.7,31.7 | v62.79,31.7 63.7,31.7 | R40.1 84.72,33.17 R41.1 88.39,33.17 89.82,33.17 L_ENCODER1.4 | 58.83,18.59 55.47,18.59 54.86,17.98 | 54.86,17.98 51.51,17.98 49.99,19.51 49.99,19.81 49.99,25.6 46.02,29.57 | C8.+ 86.16,28.04 85.34,28.04 80.77,28.04 79.86,28.96 v79.86,31.7 | J1.1 25.28,42.12 25.41,42.25 | 25.41,42.25 R27.1 | C7.+ 15.76,27.96 v15.85,28.04 | R37.1 16.54,35.14 23.66,42.25 25.41,42.25 | v19.81,29.57 20.67,28.7 C5.1 37.49,28.7 | 37.54,28.7 38.41,29.57 46.02,29.57 | 46.02,29.57 46.02,31.39 v48.16,33.53
  Bottom 0.305: v21.64,73.76 21.64,73.15 21.34,72.85 | v32,73.46 32,72.85 | v41.45,73.76 41.45,72.85 | v68.89,73.46 68.89,72.85 | v60.05,73.46 60.05,72.85 | v76.5,73.46 76.5,72.85 | v74.07,33.22 72.54,31.7 v71.32,31.7 | v30.18,39.93 28.04,42.06 26.3,42.06 J1.1 | C27.1 46.07,42.93 v43.59,45.41 | v49.38,36.88 49.38,36.58 49.07,36.27 | 57,50.6 58.52,50.6 59.74,49.38 v59.89,49.53 | v53.65,48.16 52.95,48.85 52.95,49.46 52.95,49.77
  Bottom 0.406: v17.37,71.63 20.12,71.63 21.34,72.85 32,72.85 41.45,72.85 49.99,72.85 | 49.99,72.85 v50.6,72.85 | 49.99,72.85 49.99,70.41 52.12,68.28 54.25,68.28 v55.16,69.19 v55.17,69.19 55.17,71.63 v56.39,72.85 60.05,72.85 68.89,72.85 76.5,72.85 83.82,72.85 v84.73,71.93
  Bottom 0.61: v66.45,18.59 66.45,19.58 R43.1 R42.1 | R42.1 66.23,21.98 C35.1 | R42.1 66.18,22.82 65.23,23.77 59.74,23.77 57.3,26.21 57.3,27.13 61.87,31.7 v62.79,31.7 | v79.86,31.7 v71.32,31.7 | v15.85,28.04 17.37,28.04 19.81,30.48 | 19.81,30.48 19.81,32.31 18.29,33.83 11.65,33.83 L_ENCODER.4 | 52.95,49.77 46.07,42.89 C27.1 46.07,41.41 C29.1 46.72,38.63 49.07,36.27 49.07,34.44 v48.16,33.53 | 52.95,49.46 54.08,50.6 57,50.6 | v19.81,29.57 19.81,30.48
ADC0  (via drill 0.35)  (1 unrouted)
  Top 0.305: U2.22 52.4,38.4 53.49,39.49 53.49,44.04 51.75,45.79 X1.3 | X2.10 51.75,69.73 52.12,70.1 80.77,70.1 83.52,72.85 83.52,74.98 83.82,75.29 84.54,75.29 R2.1 85.51,75.14 v85.65,75.29
  Bottom 0.305: Q4.C 85.34,75.29 v85.65,75.29
ADC1  (via drill 0.35)  (1 unrouted)
  Top 0.305: U2.23 52.04,38.75 53.03,39.75 53.03,43.59 51.25,45.37 X1.4 | X2.9 51.25,70.3 51.51,70.56 63.28,70.56 63.44,70.71 73.15,70.71 73.76,71.32 73.76,74.68 74.02,74.94 R6.1 76.15,74.94 v76.81,75.59
  Bottom 0.305: Q5.C 76.17,74.95 v76.81,75.59
ADC2  (via drill 0.35)  (1 unrouted)
  Top 0.305: U2.24 51.68,39.08 52.58,39.98 52.58,43.13 50.75,44.96 X1.5 | X2.8 50.75,70.56 51.21,71.02 63.09,71.02 63.7,71.63 63.7,74.37 64.31,74.98 64.9,74.98 R11.1 64.98,74.93 Q6.C
  Bottom 0.305: Q6.C 65.34,75.29 65.53,75.29 65.2,74.95 Q6.C
  other vias: 65,74.95
ADC3  (via drill 0.35)  (1 unrouted)
  Top 0.305: X1.6 50.25,44.54 52.12,42.67 52.12,40.16 U2.25 | X2.7 50.25,70.98 50.9,71.63 53.03,71.63 53.65,72.24 53.65,74.68 53.95,74.98 v54.56,74.98 54.99,74.98 R16.1
  Bottom 0.305: Q7.C 54.59,74.95 v54.56,74.98
ADC4  (via drill 0.35)  (1 unrouted)
  Top 0.305: U2.28 47.24,39.63 47.24,42.67 47.85,43.28 48.77,43.28 49.75,44.26 X1.7 | X2.6 49.75,70.65 48.46,71.93 45.41,71.93 44.81,72.54 44.81,74.07 | R18.1 44.01,74.86 44.81,74.07 | v45.41,74.07 44.81,74.07
  Bottom 0.305: Q8.C 45.41,74.53 v45.41,74.07
ADC5  (via drill 0.35)  (1 unrouted)
  Top 0.305: X1.8 49.25,44.68 48.46,43.89 47.55,43.89 46.79,43.13 46.79,39.37 U2.29 | X2.5 49.2,68.31 49.2,70.26 48.14,71.32 38.71,71.32 38.1,71.93 38.1,74.68 37.78,75 R20.1 35.05,75 Q9.C
  other vias: 35,74.95
ADC6  (via drill 0.35)  (1 unrouted)
  Top 0.305: X1.9 48.75,45.09 48.16,44.5 47.24,44.5 46.33,43.59 46.33,39.11 U2.30 | X2.4 48.75,69.82 47.85,70.71 29.87,70.71 27.74,72.85 27.74,74.98 27.53,75.19 R22.1 24.28,75.19 v23.77,74.68
  Bottom 0.305: Q10.C 24.05,74.95 v23.77,74.68
ADC7  (via drill 0.35)  (1 unrouted)
  Top 0.305: X1.10 48.25,45.51 47.85,45.11 46.94,45.11 45.72,43.89 45.72,39.04 U2.31 | X2.3 48.25,69.4 47.55,70.1 21.34,70.1 18.29,73.15 18.29,74.37 17.68,74.98 R24.1 15.85,74.98 14.94,74.07 v14.94,73.76
  Bottom 0.305: Q11.C 14.94,74.89 v14.94,73.76
BOOT  (via drill 0.35)
  Top 0.305: U2.94 59.35,24.69 66.75,24.69 v67.06,24.99 v71.32,24.99 | JP2.1 82.33,36 78.64,32.31 v78.64,27.13
  Bottom 0.305: R39.2 v67.06,24.99 | v71.32,24.99 73.46,27.13 v78.64,27.13
DIST_CLK  (via drill 0.35)
  Top 0.305: U2.35 41.76,40.16 41.76,48.46 | X4.3 41.76,50.8 41.76,48.46 | X5.3 73.49,35.66 72.24,35.66 71.63,36.27 71.63,37.8 62.79,46.63 v61.57,46.63 | v60.05,53.95 60.05,53.49 X3.3 | v40.84,48.16 41.15,48.46 41.76,48.46
  Bottom 0.305: v61.57,46.63 61.57,50.6 62.79,51.82 62.79,52.43 60.96,54.25 60.35,54.25 v60.05,53.95 57.61,51.51 48.46,51.51 45.11,48.16 v40.84,48.16
DIST_D0  (via drill 0.35)
  Top 0.305: X3.2 56.08,48.83 56.08,45.11 v54.56,43.59 | v51.51,35.97 48.08,35.97 U2.32
  Bottom 0.305: v51.51,35.97 51.51,40.54 v54.56,43.59
DIST_D1  (via drill 0.35)
  Top 0.305: X5.2 72.67,34.14 v69.8,34.14 | v51.82,28.96 51.51,29.26 51.51,34.14 50.29,35.36 47.97,35.36 U2.33
  Bottom 0.305: v51.82,28.96 56.39,28.96 61.57,34.14 v69.8,34.14
DIST_D2
  Top 0.305: U2.34 42.37,40.27 42.37,50.89 X4.2
GND  (via drill 0.35)  (2 unrouted)
  Top 0.305: U$3.P$6 47.19,15 C26.1 | U$3.P$7 47.42,14.5 47.11,14.8 C26.1 | U$3.P$3 49.75,17.61 49.38,17.98 | 49.38,17.98 47.24,17.98 47.09,17.83 | 47.09,17.83 46.94,17.68 46.94,14.98 C26.1 | U$3.P$2 50.25,17.72 | 50.25,17.72 49.99,17.98 49.38,17.98 | U$3.P$1 50.75,17.22 50.25,17.72 | U3.18 24.93,12.5 24.04,11.62 C13.2 | U2.74 47.09,18.86 47.09,17.83 | U1.18 75.24,12.15 74.93,11.84 C1.2 | U$4.P$2 64.95,20.68 U$4.P$5 | 62.79,28.96 62.18,28.96 60.66,27.43 60.16,27.43 U2.99 55.9,31.7 v55.17,31.7 | LED12.C 35.17,50.48 38.1,47.55 | 38.1,47.55 38.66,46.99 RESET.1 38.62,44.89 38.47,44.74 33.13,39.41 | RESET.2 33.13,39.41 | X4.4 40.7,50.15 38.1,47.55 | 58.83,47.98 R3.1 | U2.10 58.22,35.66 59.13,35.66 | C22.2 61.4,35.66 59.13,35.66 | v59.13,36.58 59.13,35.66 | v81.99,25.91 81.38,25.3 78.33,25.3 | v62.79,28.04 63.4,28.65 63.4,28.96 | v14.02,2.74 v15.54,2.74 15.55,2.75 C4.- | v21.34,2.74 v20.12,2.74 | C41.1 68.48,8.23 TP2.TP | X5.4 77.05,39.93 77.11,39.93 | X3.4 58.01,53.13 59.74,54.86 62.79,54.86 65.71,51.94 LED11.C | 33.13,39.01 33.13,39.41 | U2.49 40,32 37.49,32 36.64,32.85 C23.1 36.68,33.56 C5.2 | 44.81,46.33 45.41,45.72 47.24,45.72 47.75,46.23 X1.11 X2.2 47.75,68.99 47.55,69.19 47.24,69.19 X2.1 X1.12 47.25,46.95 46.63,46.33 45.11,46.33 v44.5,46.94 | U2.26 48.9,40.67 v49.68,41.45 | U2.19 55.17,38.97 55.17,39.32 v55.47,39.62 | 64.79,50.12
  Top 0.406: v53.95,77.11 v58.22,77.11 57.91,76.81 v57.91,71.93 | v45.41,69.12 45.49,69.19 47.24,69.19 | v24.99,11.28 24.38,11.28 24.04,11.62 | C19.2 45.41,15.56 | 45.41,15.56 46.36,15.56 47.11,14.8 | C28.2 41.71,15.55 C15.2 45.41,15.55 45.41,15.56 | U$4.P$5 66.51,21.58 v67.97,20.12 | 62.79,28.96 63.4,28.96 65.23,28.96 65.53,29.26 65.53,30.09 C6.2 | C8.- 87.17,22.55 91.14,22.55 92.35,23.77 92.35,28.04 94.49,30.18 97.23,30.18 97.61,30.56 L_ENCODER1.1 | R3.1 59.13,47.98 63.65,47.98 | C21.2 57.68,44.2 58.52,44.2 64.62,38.1 64.62,36.88 63.09,35.36 62.49,35.36 C22.2
  Top 0.508: 45.06,1.27 45.41,1.27 45.53,1.38 USB.S1 | USB.S4 53.95,6.4 52.21,6.4 USB.GND
  Top 0.61: v20.12,2.74 C4.- arc-90 C4.- | 13,21.03 C7.- 12.7,20.73 v10.97,20.73 | C43.1 C44.1 C42.1 | C42.1 57.91,12.12 57.91,9.75 | 57.91,9.75 57.91,6.1 58.83,5.18 67.67,5.18 68.06,5.57 C40.1 67.96,6.89 C41.1 68.58,9.38 68.58,10.36 67.97,10.97 67.36,10.97 | U4.4 65.23,10.65 65.23,10.67 65.53,10.97 67.36,10.97 | USB.S4 57.3,9.75 57.91,9.75 | v74.07,10.36 v74.06,10.37 C1.2 | v84.12,22.25 86.11,22.25 C8.- | v78.94,3.96 78.94,2.75 | v67.97,20.12 67.36,19.51 v67.36,16.15 v67.36,11.89 67.36,10.97 | v67.97,27.74 68.07,27.83 C24.2 69.24,29.91 C9.2 68.92,30.23 C6.2 | C42.1 57.79,12.07 v56.69,10.97 | v78.64,22.25 78.64,24.99 78.33,25.3 77.72,25.91 77.72,32.61 80.16,35.05 80.16,36.88 77.11,39.93 74.07,42.98 70.42,42.98 USER.2 USER.1 | USER.1 63.91,49.24 64.79,50.12 LED11.C | Q2.2 57.32,47.98 58.83,47.98 | 58.83,47.98 59.13,47.98 | R3.1 63.65,47.98 USER.1 | v57.91,49.07 58.83,48.16 58.83,47.98 | J1.7 19.81,35.57 19.81,31.7 21.64,29.87 27.43,29.87 v30.48,32.92 35.96,32.92 C23.1 36.58,33.66 36.58,37.19 35.97,37.8 34.48,37.8 C25.1 33.13,38.95 33.13,39.01 | RESET.2 38.47,44.74
  Top 0.813: JP3.1 73.51,5.44 72.15,6.79 C40.1 | USB.S3 54.79,1.22 55.17,1.22 | USB.S1 44.84,1.49 v43.89,2.44 | v43.89,7.01 45.5,7.01 USB.S2 | 44.81,46.33 44.5,46.63 v44.5,46.94 | v36.27,44.81 38.53,44.81 38.62,44.89
  Top 1.016: C4.- 19.53,1.22 55.17,1.22 80.47,1.22 C10.- 78.94,2.75 74.42,2.75 JP3.1
  Bottom 0.305: LED9.C 88,22.25 v84.12,22.25 | v55.17,31.7 59.13,35.66 v59.13,36.58 56.08,39.62 v55.47,39.62 | v35.05,17.68 35.36,17.37 v35.36,8.84 37.19,7.01 v43.89,7.01 | v43.89,7.01 v43.89,2.44 | v43.89,7.01 46.94,10.06 47.24,10.06 | 47.24,10.06 v52.12,10.06 52.12,11.28 52.73,11.89 | v47.85,16.46 v46.02,14.63 46.02,11.28 47.24,10.06 | v56.69,5.79 56.69,10.06 55.78,10.97 | 55.17,10.97 56.69,12.5 v56.69,13.11 56.69,16.76 57.3,16.76 v57.91,17.37 | v70.41,11.89 v67.36,11.89 | v72.24,21.03 70.5,21.03 C35.2 | v77.72,3.96 v78.94,3.96 | v57.61,69.12 57.38,69.34 56.84,69.34 | v46.33,68.2 v45.41,69.12 | v49.68,41.45 49.38,41.15 48.62,41.15
  Bottom 0.406: Q11.E 15.61,77.05 16.76,75.89 22.86,75.89 24.02,77.05 Q10.E 25.97,77.05 27.13,75.89 32.61,75.89 33.83,77.11 34.94,77.11 Q9.E 36.03,77.05 37.19,75.89 42.37,75.89 43.59,77.11 44.94,77.11 Q8.E 45.85,76.2 53.34,76.2 | Q7.E 54.15,76.2 53.34,76.2 | Q4.E 84.15,76.2 81.08,76.2 80.23,77.05 Q5.E 74.15,76.2 69.49,76.2 68.64,77.05 Q6.E 64.15,76.2 59.13,76.2 v58.22,77.11 | v53.95,77.11 53.95,76.81 53.34,76.2 | v57.91,71.93 57.91,70.41 56.84,69.34 53.95,66.45 46.63,66.45 45.41,67.67 v45.41,69.12 | 25.15,10.52 25.15,11.12 v24.99,11.28 | v67.97,20.12 69.19,20.12 69.56,20.48 C35.2 69.56,24.41 R39.1
  Bottom 0.61: C33.1 27.23,17.7 C32.1 27.11,17.73 C16.2 25.82,16.77 R36.1 25.82,11.19 25.15,10.52 20.12,5.49 20.12,4.57 | 20.12,4.57 v20.12,2.74 | v10.97,20.73 9.75,19.51 9.75,14.02 | 9.75,14.02 9.75,8.23 13.41,4.57 20.12,4.57 | C17.1 C18.1 76.91,16.46 76.5,16.46 76.12,16.85 C20.2 76.21,17.94 R1.1 76.21,12.51 74.68,10.97 | 74.68,10.97 v74.07,10.36 | C17.1 78.92,21.93 79.86,22.86 83.52,22.86 v84.12,22.25 | 74.68,10.97 78.94,6.71 v78.94,3.96 | R39.1 69.48,27.14 68.89,27.74 v67.97,27.74 | C17.1 78.64,21.19 v78.64,22.25 | v56.69,10.97 55.78,10.97 55.17,10.97 53.65,10.97 52.73,11.89 50.6,14.02 50.6,17.37 51.21,17.98 53.03,17.98 53.34,18.29 53.34,20.42 51.51,22.25 50.6,22.25 49.99,22.86 49.99,25.91 | 9.75,14.02 8.98,13.25 LED10.C 2.86,13.11 2.13,13.11 1.52,13.72 1.52,29.26 2.9,30.64 L_ENCODER.1 2.9,35.21 3.66,35.97 19.58,35.97 J1.7 J1.8 | v57.91,49.07 57.91,48.26 52.24,42.59 C27.2 48.62,41.94 48.62,41.15 C29.2 50.29,39.09 50.29,26.21 49.99,25.91 | 49.99,25.91 37.8,25.91 30.79,32.92 v30.48,32.92
  Bottom 0.813: v44.5,46.94 40.84,46.94 38.71,44.81 v36.27,44.81
  other vias: 27.43,19.51 46.94,26.21 39.93,25.91 43.89,28.35 42.98,36.27 23.77,26.82 18.9,22.56 92.35,6.4 51.21,22.56 63.7,41.76 54.86,53.34 45.11,53.34 23.16,6.71 68.88,38.4 75.9,37.8 61.87,54.56 38.1,54.56 35.97,39.32 9.45,28.65 9.45,1.52 35.36,5.18 90.53,1.52 90.53,28.65 83.52,12.8 75.59,26.21 75.59,33.22 42.06,61.26 42.98,61.26 43.89,61.26 44.81,61.26 45.72,61.26 46.63,61.26 47.55,61.26 48.46,61.26 49.38,61.26 50.29,61.26 51.21,61.26 52.12,61.26 53.04,61.26 53.95,61.26 54.86,61.26 55.78,61.26 56.69,61.26 57.61,61.26 41.59,60.66 58.05,60.66 42.5,60.66 57.13,60.66 43.42,60.66 56.22,60.66 44.33,60.66 55.3,60.66 45.24,60.66 54.39,60.66 46.16,60.66 53.47,60.66 52.56,60.66 47.07,60.66 47.99,60.66 51.64,60.66 50.73,60.66 48.9,60.66 49.82,60.66 58.66,61.27 59.26,60.66 40.98,61.27 40.37,60.66 41.61,77.12 21.61,77.12 31.61,77.12 68.61,77.12 78.61,77.12 83.61,70.12 77.61,72.12 16.61,70.12 24.61,71.12 32.36,9.84 20.16,12.71
  pour Top: -10.06,85.95 119.79,85.95 119.79,-9.45 -10.06,-9.45
  pour Bottom: -28.65,100.28 104.85,100.28 104.85,-9.75 -28.65,-9.75
KEY
  Top 0.305: U2.3 61.34,33.83 66.75,33.83 68.28,35.36 68.28,36.99 USER.4
L_A
  Top 0.305: U2.66 44.5,21.95 | 44.5,21.95 | U3.6 23.93,21.19 24.69,21.95 25.57,21.95 25.72,22.1 27.32,22.1 28.38,21.03 43.59,21.03 44.5,21.95
L_B
  Top 0.305: U3.7 23.47,19.91 23.47,21.38 24.5,22.4 24.54,22.4 24.99,22.86 27.43,22.86 28.65,21.64 43.48,21.64 U2.65
L_C
  Top 0.305: U3.8 22.93,21.71 23.01,21.79 24.08,22.86 24.23,23.01 24.54,23.32 27.62,23.32 28.69,22.25 43.4,22.25 U2.64
L_ENABLE
  Top 0.305: U3.5 24.43,20.77 24.93,21.27 | U3.2 25.93,21.01 25.6,21.34 | 25.6,21.34 25.3,21.34 | 25.3,21.34 24.99,21.34 24.93,21.27 | U3.3 25.43,21.21 25.3,21.34 | U3.4 24.93,21.27 | 25.6,21.34 25.91,21.64 27.13,21.64 28.35,20.42 43.69,20.42 U2.67
L_I  (via drill 0.35)
  Top 0.305: U2.18 52.12,35.21 52.12,30.18 53.03,29.26 53.03,28.35 52.43,27.74 50.6,27.74 49.68,28.65 49.68,29.57 49.38,29.87 v47.55,29.87 | v32.92,24.99 35.05,27.13 37.8,27.13 v38.71,28.04
  Bottom 0.305: R7.2 22.07,21.51 22.97,20.62 | 22.97,20.62 C16.1 | 22.97,20.62 22.97,21.75 24.08,22.86 30.79,22.86 v32.92,24.99 | v47.55,29.87 45.11,27.43 39.32,27.43 v38.71,28.04
L_SCL  (via drill 0.35)
  Top 0.305: U2.61 42.5,23.47 32.31,23.47 30.79,24.99 21.64,24.99 16.46,30.18 16.46,31.34 R37.2 18.31,31.42 v18.59,31.7
  Bottom 0.305: v18.59,31.7 17.37,30.48 8.23,30.48 7.92,30.79 7.92,32.65 L_ENCODER.3
L_SDA
  Top 0.305: U2.62 42.58,22.86 32,22.86 30.48,24.38 21.34,24.38 14.3,31.42 R4.2 12.96,30.18 7.62,30.18 5.44,32.36 L_ENCODER.2
L_YA
  Top 0.406: U3.26 U3.9 19.51,18.41 15.97,18.41 14.94,17.37 12.87,17.37 U$1.P$1
L_YB
  Top 0.406: U3.24 U3.11 19.57,17.01 19.51,16.95 16.64,16.95 14.63,14.94 12.77,14.94 U$1.P$2
L_YC
  Top 0.406: U$1.P$3 17.64,12.46 20.79,15.61 U3.13 U3.22
LED_1  (via drill 0.35)
  Top 0.305: U2.2 61.45,33.22 67.06,33.22 70.41,36.58 v70.41,37.19 | v72.54,44.2 71.37,45.36 R28.2
  Bottom 0.305: v70.41,37.19 70.41,42.06 v72.54,44.2
LED_2  (via drill 0.35)
  Top 0.305: U2.1 61.52,32.61 71.63,32.61 73.46,30.79 73.46,26.52 75.59,24.38 v76.81,24.38
  Bottom 0.305: R9.2 93.05,20.95 89.61,24.38 v76.81,24.38
LED_3  (via drill 0.35)
  Top 0.305: U2.60 42.39,24.08 32.61,24.08 v30.18,26.52
  Bottom 0.305: R38.2 4.3,22.25 17.07,22.25 18.9,24.08 24.08,24.08 26.52,26.52 v30.18,26.52
LINE_LED  (via drill 0.35)  (1 unrouted)
  Top 0.305: X2.11 52.25,69.32 52.43,69.49 53.34,69.49 v53.65,69.19 | X1.2 52.25,46.81 53.03,46.02 54.56,46.02 54.99,46.46 Q2.3
  Bottom 0.406: v53.65,69.19 53.65,71.32 57,74.68 57,78.64 | LED7.C 18.89,78.64 28.04,78.64 | LED1.C 82,78.33 81.69,78.64 71.93,78.64 | 28.04,78.64 38.1,78.64 | 38.1,78.64 48.16,78.64 | 48.16,78.64 52.12,78.64 | 52.12,78.64 57,78.64 | 57,78.64 61.87,78.64 | 61.87,78.64 71.93,78.64 | LED2.C 71.93,77.82 71.93,78.64 | LED3.C 61.87,77.88 61.87,78.64 | LED4.C 52,78.52 52.12,78.64 | LED8.C 48,78.48 48.16,78.64 | LED5.C 38,78.54 38.1,78.64 | LED6.C 28,78.6 28.04,78.64
LINE_LED_CONTROLL
  Top 0.305: Q2.1 58.89,45.95 R3.2 58.83,45.89 58.83,44.81 66.75,36.88 66.75,36.27 65.23,34.75 58.02,34.75 U2.9
MEM_SCL  (via drill 0.35)
  Top 0.305: U2.85 56.1,21.58 61.27,21.58 | 61.27,21.58 U$4.P$1 | v61.57,22.25 61.57,21.89 61.27,21.58
  Bottom 0.305: R42.2 61.9,21.92 v61.57,22.25
MEM_SDA  (via drill 0.35)
  Top 0.305: U2.84 57.18,19.78 60.35,19.78 | 60.35,19.78 U$4.P$3 | v60.35,20.42 60.35,19.78
  Bottom 0.305: R43.2 60.93,19.84 v60.35,20.42
N$1  (via drill 0.35)
  Top 0.406: U3.10 19.23,17.71 v19.2,17.68 | U3.12 19.36,16.31 v19.2,16.15
  Bottom 0.406: v19.2,17.68 19.2,19.2
  Bottom 0.61: R7.1 20.88,19.51 19.51,19.51 19.2,19.2 v19.2,16.15 20.27,15.09 R36.2
N$2
  Top 0.305: U1.14 72.25,13.11 72.24,13.11 72.16,13.03 C1.1
N$3
  Top 0.305: U1.21 77.12,13.72 78.94,13.72 79.55,13.11 79.55,12.06 C2.1
N$4
  Top 0.305: U1.20 76.24,12.15 76.5,11.89 77.48,11.89 C2.2
N$5
  Top 0.305: U1.19 75.74,10.23 C3.1
N$6
  Top 0.508: USB.VBUS 48.43,7.96 46.94,9.45 43.28,9.45 41.15,7.32 D1.A
N$7
  Top 0.813: JP1.1 46.92,3.68 47.85,2.74 52.12,2.74 53.34,3.96 55.78,3.96 56.69,3.05 70.36,3.05 JP3.2
N$8  (via drill 0.35)
  Top 0.406: U1.10 69.98,17.56 69.49,17.07 69.49,16.46 69.8,16.16 U1.12 v68.89,16.16 v68.89,16.15
  Bottom 0.406: v68.89,16.15 69.8,15.24 | 69.8,15.24 70.1,14.94 73.31,14.94 R1.2 | R8.1 69.95,15.39 69.8,15.24
N$9
  Bottom 0.305: LED9.A R9.1
N$10
  Top 0.406: U3.14 22.93,12.4 C13.1
N$11
  Bottom 0.305: LED10.A R38.1
N$12
  Top 0.305: U3.19 25.43,12.7 25.47,12.66 25.47,12.63 27.13,10.97 C31.1
N$14  (via drill 0.35)
  Top 0.305: R5.1 78.83,75.09 v78.64,75.29
  Bottom 0.305: v78.64,75.29 80.96,75.29 LED1.A
N$15  (via drill 0.35)
  Top 0.305: R10.1 70.41,74.98 v70.56,74.83
  Bottom 0.305: v70.56,74.83 71.42,74.83 LED2.A
N$16  (via drill 0.35)
  Bottom 0.305: LED3.A 62,74.63 R12.1
  other vias: 62.1,74.72
N$17  (via drill 0.35)
  Top 0.305: R17.1 50.68,74.76 v50.6,74.68
  Bottom 0.305: v50.6,74.68 51.57,74.68 LED4.A
N$18  (via drill 0.35)
  Top 0.305: v40.84,74.98 40.66,74.79 R19.1
  Bottom 0.305: LED5.A 38.73,74.98 v40.84,74.98
N$19  (via drill 0.35)
  Top 0.305: R21.1 30.98,75.09 v31.09,74.98
  Bottom 0.305: LED6.A 28.73,74.98 v31.09,74.98
N$20  (via drill 0.35)
  Top 0.305: R23.1 19.92,74.98 v18.9,74.98
  Bottom 0.305: v18.9,74.98 18.17,74.25 LED7.A
N$21  (via drill 0.35)
  Top 0.305: R25.1 49.29,74.89 v49.38,74.98
  Bottom 0.305: v49.38,74.98 48.65,74.25 LED8.A
N$22
  Top 0.61: U4.6 62.53,9.19 61.87,8.53 61.06,8.53 C39.2
N$23
  Top 0.61: R27.2 31.17,48.01 LED12.A
N$25
  Top 0.305: U2.73 45.26,17.75 C19.1
N$26
  Top 0.61: U4.5 63.48,12.39 | 63.48,12.39 L1.P$1 | C39.1 61.87,11.35 61.87,12.5 63.38,12.5 63.48,12.39
N$30
  Top 0.305: U2.48 39.13,33.6 C23.2
N$31
  Top 0.305: U3.21 26.65,14.03 C30.1
N$33
  Top 0.305: LED11.A 69.92,46.83 R28.1
N$34
  Top 0.305: U3.20 25.93,13.09 27.13,11.89 28.65,11.89 C30.2
OSCIN
  Top 0.305: U2.12 58.22,37.06 58.22,38.41 59.74,39.93 61.08,39.93 Q1.3 63.13,37.88 C22.1
OSCOUT
  Top 0.305: U2.13 57.3,36.87 57.3,40.31 Q1.1 56.95,40.96 C21.1
R_A
  Top 0.305: U2.95 59.46,25.3 66.14,25.3 66.75,25.91 71.93,25.91 74.24,23.6 U1.6
R_B
  Top 0.305: U1.7 73.74,22.88 72.54,24.08 59.24,24.08 U2.93
R_C
  Top 0.305: U2.92 59.17,23.47 65.23,23.47 66.45,23.47 72.24,23.47 73.24,22.47 U1.8
R_ENABLE
  Top 0.305: U1.5 74.74,21.95 | 74.74,21.95 74.74,24.02 72.24,26.52 66.45,26.52 65.84,25.91 59.53,25.91 U2.96 | U1.4 75.24,21.45 74.74,21.95 | U1.3 75.74,21.8 | 75.74,21.8 75.59,21.95 74.74,21.95 | U1.2 76.24,21.3 75.74,21.8
R_I  (via drill 0.35)
  Top 0.305: U2.17 52.73,35.13 52.73,31.39 53.95,30.18 53.95,27.13 v52.73,25.91
  Bottom 0.305: R8.2 71.85,19.29 71.63,19.51 69.49,19.51 67.06,17.07 61.57,17.07 v52.73,25.91
  Bottom 0.406: C20.1 R8.2
R_SCL  (via drill 0.35)
  Top 0.305: U2.98 59.85,27.03 64.82,27.03 65.84,28.04 v65.84,28.35 | v88.09,31.7 87.66,31.27 R41.2
  Top 0.406: L_ENCODER1.3 92.53,31.57 91.75,30.79 87.44,30.79 R41.2
  Bottom 0.305: v65.84,28.35 65.84,28.65 67.06,29.87 81.69,29.87 83.52,31.7 v88.09,31.7
R_SDA  (via drill 0.35)
  Top 0.305: U2.97 59.64,26.52 65.23,26.52 67.36,28.65 v67.36,28.96
  Top 0.406: R40.2 83.82,30.37 v83.82,30.18
  Bottom 0.305: v67.36,28.96 72.24,28.96 72.54,28.65 82.3,28.65 83.97,30.33
  Bottom 0.406: v83.82,30.18 83.97,30.33 84.43,30.79 94.79,30.79 95.1,31.09 95.1,32.98 L_ENCODER1.2
R_YA
  Top 0.406: U1.9 U1.26 76.98,18.29 78.64,18.29 79.86,19.51 85.33,19.51 U$2.P$3
R_YB
  Top 0.406: U1.11 U1.24 80.98,16.86 81.69,16.15 86.15,16.15 U$2.P$2
R_YC
  Top 0.406: U1.13 U1.22 79.34,15.46 80.47,14.33 85.43,14.33 U$2.P$1
RESET  (via drill 0.35)
  Top 0.305: RESET.3 RESET.4 29.86,42.03 J1.2 30.2,36.12 R15.1 31.58,35.8 C25.2 34.44,35.74 v34.44,34.44 | U2.14 53.65,33.93 53.65,31.39 55.17,29.87 55.17,26.52 52.43,23.77 51.51,23.77 51.21,24.08 51.21,25.91 v48.77,28.35
  Bottom 0.305: v34.44,34.44 43.59,34.44 46.63,31.39 47.85,31.39 48.77,30.48 v48.77,28.35
SCL  (via drill 0.35)
  Top 0.305: U$3.P$13 52.43,15 52.67,15 | 52.67,15 53.03,14.63 53.03,13.43 R14.1 | U2.83 55.78,20.5 v55.78,20.12 | v53.65,15.24 53.41,15 52.67,15
  Bottom 0.305: v55.78,20.12 55.78,17.37 v53.65,15.24
SDA  (via drill 0.35)
  Top 0.305: U$3.P$14 51.25,15.89 52.06,16.7 R13.1 52.49,16.7 v52.12,17.07 | U2.82 54.56,21 v54.56,20.42
  Bottom 0.305: v52.12,17.07 54.25,17.07 54.56,17.37 v54.56,20.42
SWCLK  (via drill 0.35)
  Top 0.305: U2.76 52.12,19.2 v52.12,18.9 | v24.38,32.92 26.21,34.75 26.21,36.52 J1.4
  Bottom 0.305: v52.12,18.9 49.38,18.9 48.16,17.68 44.2,17.68 42.98,16.46 41.45,16.46 35.05,22.86 35.05,24.08 31.85,27.28 31.7,27.43 29.87,27.43 v24.38,32.92
SWDIO  (via drill 0.35)
  Top 0.305: U2.72 45.38,18.59 43.28,18.59 42.67,17.98 v42.67,17.68
  Bottom 0.305: v42.67,17.68 32,28.35 30.79,28.35 J1.6
UART_RX  (via drill 0.35)
  Top 0.305: U2.69 47.84,23.16 v48.46,23.16
  Bottom 0.305: v48.46,23.16 44.5,19.2 42.06,19.2 32.31,28.96 32,28.96 27.13,33.83 27.13,37.49 25.37,39.25 J1.3
UART_TX  (via drill 0.35)
  Top 0.305: U2.68 48.34,24.38 v48.77,24.38 | v24.59,31.29 27.43,34.14 v28.25,34.14
  Bottom 0.305: v48.77,24.38 48.16,24.38 44.2,20.42 41.76,20.42 32.61,29.57 32.21,29.57 28.25,33.53 v28.25,34.14 | J1.5 21.74,37.4 21.74,35.56 23.37,33.93 23.37,32.31 24.38,31.29 v24.59,31.29
USBDM
  Top 0.305: USB.D- 49.23,8.68 47.24,10.67 39.32,10.67 37.49,12.5 37.49,15.54 41.76,19.81 45.2,19.81 U2.70
USBDP
  Top 0.305: USB.D+ 50.03,8.8 47.55,11.28 39.62,11.28 38.1,12.8 38.1,15.24 38.71,15.85 39.22,15.85 R26.2 39.59,16.12 41.45,17.98 41.76,18.29 42.67,19.2 45.28,19.2 U2.71
VCC  (via drill 0.35)
  Top 0.406: U1.23 80.16,16.16 81.08,15.24 v81.99,15.24 | U1.25 79.73,17.56 80.47,18.29 81.69,18.29 81.99,17.98 v81.99,17.37
  Top 0.508: D1.C 25.91,7.3 25.91,3.68 25.91,3.37 | C31.2 29.46,10.26 | 31.09,16.15 31.09,13.72 | 31.09,16.15 31.09,17.07 31.09,17.37 30.75,17.71 U3.25 | U3.23 30.93,16.31 31.09,16.15
  Top 0.61: v31.09,18.29 31.09,17.07 | 31.09,17.37 31.09,13.72 31.09,11.89 29.46,10.26 | U4.2 U4.3 65.84,7.11 C40.2 66.06,6.89 C41.2 66.06,9.67 v66.14,9.75 | C3.2 79.17,10.14 80.06,9.25 C10.+ v82,11.27 v81.99,11.28
  Top 0.813: C31.2 29.03,8.92 27.13,7.01 26.2,7.01 D1.C 25.89,3.39 25.91,3.37
  Top 1.016: JP1.2 25.91,3.68 | 25.91,3.37 23.88,3.37 C4.+ | v84.12,9.45 83.93,9.25 C10.+
  Bottom 0.406: v81.99,15.24 81.99,16.46
  Bottom 0.61: C32.2 29.13,17.7 C33.2 30.38,18.59 31.09,18.59 v31.09,18.29 | v66.14,9.75 71.32,9.75 75.89,5.18 75.89,1.52 75.59,1.22 | v81.99,11.28 81.99,16.46 v81.99,17.37 81.99,18.29 81.81,18.47 C18.2 C17.2
  Bottom 1.016: JP1.2 26.81,1.84 27.43,1.22 75.59,1.22 80.77,1.22 84.12,4.57 v84.12,9.45

### Text on the board
tValues: +